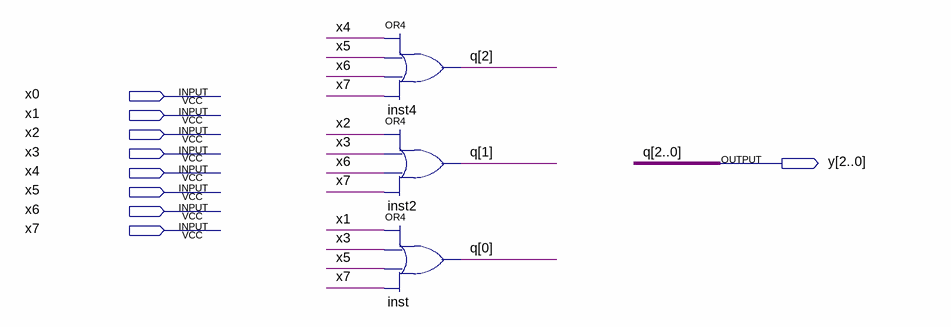
[diagram p0: schematic sheet]
// Quartus schematic Encoder.bdf as structural Verilog: 3 symbols, 9 pins
module Encoder (
  input  x0,
  input  x1,
  input  x2,
  input  x3,
  input  x4,
  input  x5,
  input  x6,
  input  x7,
  output [2:0] y
);

  or inst4 (y[2], x4, x5, x6, x7);
  or inst2 (y[1], x2, x3, x6, x7);
  or inst (y[0], x1, x3, x5, x7);

  // Other names for the same wires on the sheet: q[2:0] = y
endmodule
